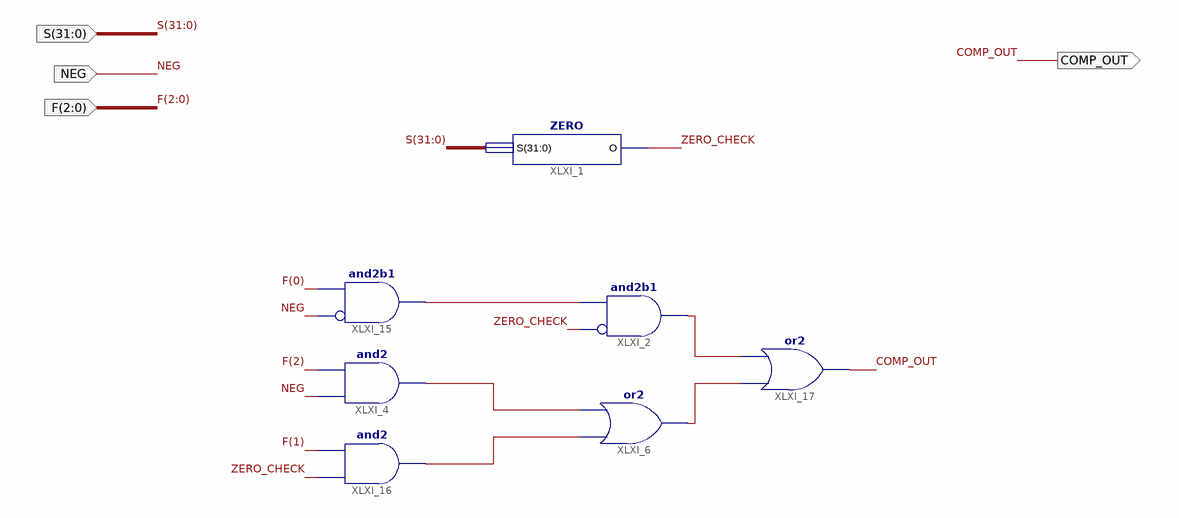
[diagram p0: schematic sheet 1]
// Xilinx ISE schematic Comparator.sch (spartan6) as structural Verilog: 7 symbols, 4 ports
module Comparator (
  input  [31:0] S,
  input  NEG,
  input  [2:0] F,
  output COMP_OUT
);

  wire O_0, O_1, O_2, O_3, O_4, ZERO_CHECK;

  and XLXI_4 (O_2, NEG, F[2]);
  and XLXI_15 (O_0, ~NEG, F[0]);  // and2b1
  and XLXI_16 (O_1, ZERO_CHECK, F[1]);
  or XLXI_17 (COMP_OUT, O_4, O_3);
  and XLXI_2 (O_3, ~ZERO_CHECK, O_0);  // and2b1
  or XLXI_6 (O_4, O_1, O_2);
  ZERO XLXI_1 (.S(S), .O(ZERO_CHECK));
endmodule
